# Altium project SymphonyLights_MCU.PrjPcb
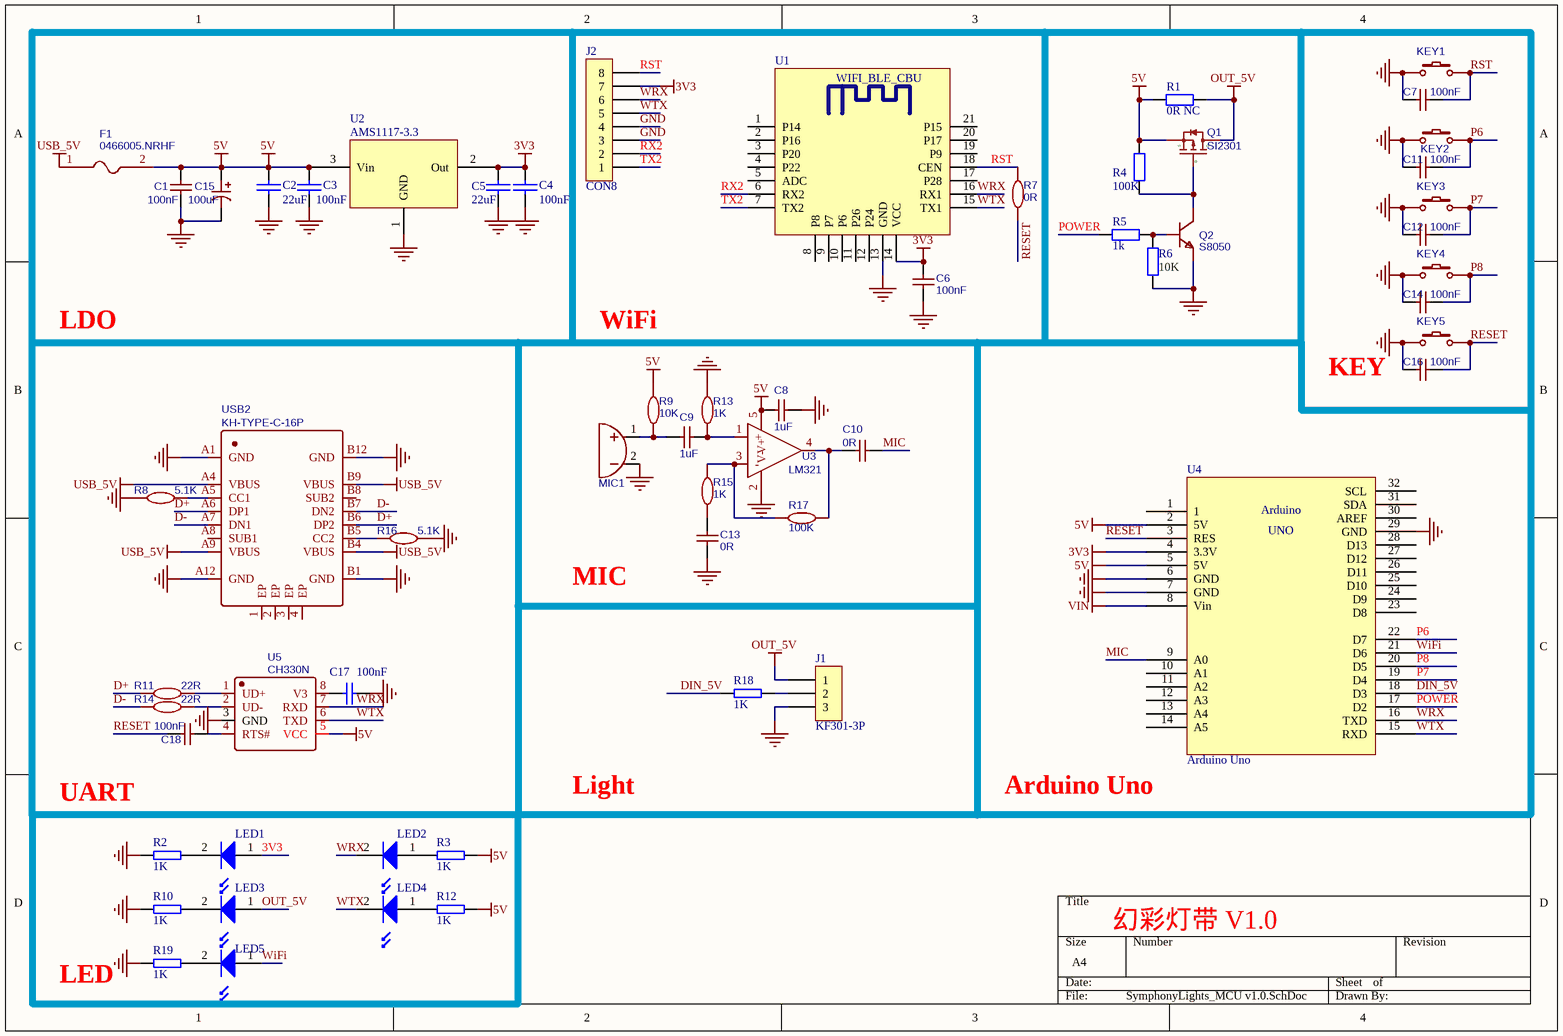
[diagram p0: SymphonyLights_MCU v1.0.SchDoc]
1 sheet, 59 parts. Net scope: global (net labels, ports and power ports of the same name join across sheets).
Board file: SymphonyLights_MCU v1.0.PcbDoc

## Sheet SymphonyLights_MCU v1.0.SchDoc
size A4

### Parts
C1  100nF  [0805C]
C2  22uF  [0805C]
C3  100nF  [0805C]
C4  100nF  [0805C]
C5  22uF  [0805C]
C6  100nF  [0805C]
C7  100nF  [0805C]
C8  1uF  [0805C]
C9  1uF  [0805C]
C10  0R  [0805C]
C11  100nF  [0805C]
C12  100nF  [0805C]
C13  0R  [0805C]
C14  100nF  [0805C]
C15  100uF  [CAP-TH_BD6.3-P2.50-D1.0-FD]
C16  100nF  [0805C]
C17  100nF  [0805C]
C18  100nF  [0805C]
F1  0466005.NRHF  [1206F]
J1  KF301-3P  [SIP3 - 2.54]
J2  CON8  [HDR1X8Z]
KEY1  RESET  [按键]  (value not drawn)
KEY2  场景  [按键]  (value not drawn)
KEY3  音乐  [按键]  (value not drawn)
KEY4  开关  [按键]  (value not drawn)
KEY5  开关  [按键]  (value not drawn)
LED1  LED  [0805LED]  (value not drawn)
LED2  LED  [0805LED]  (value not drawn)
LED3  LED  [0805LED]  (value not drawn)
LED4  LED  [0805LED]  (value not drawn)
LED5  LED  [0805LED]  (value not drawn)
MIC1  GMI6050P-66DB  [MIC-TH_BD6.0-P1.90-D0.4-L-RD]  (value not drawn)
Q1  SI2301  [SOT-23(SOT-23-3)]
Q2  S8050  [SOT-23(SOT-23-3)]
R1  0R NC  [0805R]
R2  1K  [0805R]
R3  1K  [0805R]
R4  100K  [0805R]
R5  1k  [0805R]
R6  10K  [0805R]
R7  0R  [0805R]
R8  5.1K  [0805R]
R9  10K  [0805R]
R10  1K  [0805R]
R11  22R  [0805R]
R12  1K  [0805R]
R13  1K  [0805R]
R14  22R  [0805R]
R15  1K  [0805R]
R16  5.1K  [0805R]
R17  100K  [0805R]
R18  1K  [0805R]
R19  1K  [0805R]
U1  WIFI_BLE_CBU  [WIFI_BLE_CBU]  (value not drawn)
U2  AMS1117-3.3  [SOT-223]
U3  LM321  [SOT-23-5]
U4  Arduino Uno  [Arduino UNO-2]
U5  CH330N  [SOP-8_L4.9-W3.9-P1.27-LS6.0-BL]
USB2  KH-TYPE-C-16P  [USB-C-SMD_KH-TYPE-C-16P]

### Nets
3V3: C4.1 C5.1 C6.2 J2.7 LED1.1 U1.14(VCC) U2.2(Out) U4.4(3.3V)
5V: C1.2 C2.1 C3.1 C8.1 C15.1 F1.2 Q1.2(S) R1.1 R3.1 R4.2 R9.1 R12.1 U2.3(Vin) U3.5(V+) U4.2(5V) U4.5(5V) U5.5(VCC)
GND: C1.1 C2.2 C3.2 C4.2 C5.2 C6.1 C7.1 C8.2 C11.1 C12.1 C13.2 C14.1 C15.2 C16.1 C17.1 J1.3 J2.3 J2.4 KEY1.2 KEY2.1 KEY3.2 KEY4.2 KEY5.2 MIC1.2 Q2.2(E) R2.2 R6.2 R8.1 R10.2 R13.1 R16.1 R19.2 U1.13(GND) U2.1(GND) U3.2(V-) U4.6(GND) U4.7(GND) U4.29(GND) U5.3(GND) USB2.A1(GND) USB2.A12(GND) USB2.B1(GND) USB2.B12(GND)
OUT_5V: J1.1 LED3.1 Q1.3(D) R1.2
USB_5V: F1.1 USB2.A4(VBUS) USB2.A9(VBUS) USB2.B4(VBUS) USB2.B9(VBUS)
VIN: U4.8(Vin)
D+: R11.2 USB2.A6(DP1) USB2.B6(DP2)
D-: R14.2 USB2.A7(DN1) USB2.B7(DN2)
DIN_5V: R18.1 U4.18(D3)
MIC: C10.1 U4.9(A0)
P6: C11.2 KEY2.2 U4.22(D7)
P7: C12.2 KEY3.1 U4.19(D4)
P8: C14.2 KEY4.1 U4.20(D5)
POWER: R5.1 U4.17(D2)
RESET: C16.2 C18.1 KEY5.1 R7.2 U4.3(RES)
RST: C7.2 J2.8 KEY1.1 R7.1 U1.18(CEN)
RX2: J2.2 U1.6(RX2)
TX2: J2.1 U1.7(TX2)
WiFi: LED5.1 U4.21(D6)
WRX: J2.6 LED2.2 U1.16(RX1) U4.16(TXD) U5.7(RXD)
WTX: J2.5 LED4.2 U1.15(TX1) U4.15(RXD) U5.6(TXD)
NetC9_1: C9.1 R13.2 U3.1(+)
NetC9_2: C9.2 MIC1.1 R9.2
NetC10_2: C10.2 R17.2 U3.4
NetC13_1: C13.1 R15.1
NetC17_2: C17.2 U5.8(V3)
NetC18_2: C18.2 U5.4(RTS#)
NetJ1_2: J1.2 R18.2
NetLED1_2: LED1.2 R2.1
NetLED2_1: LED2.1 R3.2
NetLED3_2: LED3.2 R10.1
NetLED4_1: LED4.1 R12.2
NetLED5_2: LED5.2 R19.1
NetQ1_1: Q1.1(G) Q2.3(C) R4.1
NetQ2_1: Q2.1(B) R5.2 R6.1
NetR8_2: R8.2 USB2.A5(CC1)
NetR11_1: R11.1 U5.1(UD+)
NetR14_1: R14.1 U5.2(UD-)
NetR15_2: R15.2 R17.1 U3.3(-)
NetR16_2: R16.2 USB2.B5(CC2)

Not connected (* = marked no-connect by the designer): U1 1(P14) 2(P16) 3(P20) 4(P22) 5(ADC) 8(P8) 9(P7) 10(P6) 11(P26) 12(P24) 17(P28) 19(P9) 20(P17) 21(P15); U4 1 10(A1) 11(A2) 12(A3) 13(A4) 14(A5) 23(D8) 24(D9) 25(D10) 26(D11) 27(D12) 28(D13) 30(AREF) 31(SDA) 32(SCL); USB2 1(EP) 2(EP) 3(EP) 4(EP) A8(SUB1) B8(SUB2)

### Notes on the sheet
- LDO
- WiFi
- KEY
- MIC
- UART
- Light
- (near U4) Arduino Uno
- LED
- 幻彩灯带 V1.0
- (in symbol Arduino Uno) Arduino; UNO

### Library data of the parts
C1 C6-C14 C16 C18 = 100nF: BOM_Manufacturer: FH; BOM_Manufacturer Part: 0805B104K500NT; nameAlias: Capacitance; BOM_Supplier: LCSC; BOM_Supplier Part: C38141; spicePre: C; spiceSymbolName: 0805B104K500NT
C2-C5 = CAP: Capacitor
C15 = 8101LCMAA08E2RR00O: Contributor: LCSC; BOM_Supplier: LCSC; BOM_Supplier Part: C723077; BOM_Manufacturer Part: 8101LCMAA08E2RR00O; JLCPCB Part Class: Extended Part; spicePre: C; spiceSymbolName: 8101LCMAA08E2RR00O
C17 = Cap: 普通电容
F1 = 0466005.NRHF: BOM_Manufacturer: Littelfuse; BOM_Supplier: LCSC; BOM_Manufacturer Part: 0466005.NRHF; BOM_Supplier Part: C57525; spicePre: F; spiceSymbolName: 0466005.NRHF
J1 = CON3: Connector
J2 = CON8: Connector
KEY1-KEY5 = (no symbol name): BOM_Manufacturer Part: K2-1107ST-A4SW-06; Contributor: LCEDA_Lib; BOM_Supplier Part: C118141; BOM_Supplier: LCSC; spicePre: K
MIC1 = GMI6050P-66DB: BOM_Manufacturer: INGHAi; Contributor: LCSC; BOM_Supplier: LCSC; BOM_Supplier Part: C233954; BOM_Manufacturer Part: GMI6050P-66DB; spicePre: M; spiceSymbolName: GMI6050P-66DB
Q1 = SI2301: BOM_Manufacturer: Hottech; Contributor: lengyuefeng; SMT Type: Extend; BOM_Supplier: LCSC; BOM_Manufacturer Part: SI2301; BOM_Supplier Part: C181086; BOM_LCSC Assembly: Yes; spicePre: Q; spiceSymbolName: SI2301
Q2 = S8050: BOM_Manufacturer: CJ; SMT Type: Basic; BOM_Supplier: LCSC; BOM_Manufacturer Part: S8050; image: //image.lceda.cn/szlcsc/C2146.jpg; BOM_Supplier Part: C2146; BOM_LCSC Assembly: Yes; spicePre: Q; spiceSymbolName: S8050
R1 R4-R6 = Res2: Resistor; Published: 8-Jun-2000; LatestRevisionDate: 17-Jul-2002; LatestRevisionNote: Re-released for DXP Platform.; Publisher: Altium Limited
R2 R3 R10 R12 R18 R19 = RES5
R7-R9 R11 R13-R17 = 10K: BOM_Manufacturer: ResistorToday; BOM_Manufacturer Part: AECR0402F10K0K9; nameAlias: Resistance (Ohms); Contributor: LCSC; Package Display: No; BOM_Supplier: LCSC; BOM_Supplier Part: C328298; spicePre: R; spiceSymbolName: AECR0402F10K0K9
U1 = WIFI_BLE_CBU: Module
U2 = GM1117
U3 = LM321: Contributor: KiCAD; license: https://www.gnu.org/licenses/lgpl-2.1.html; spicePre: U; spiceSymbolName: LM321
U5 = CH330N: BOM_Manufacturer: WCH; BOM_Supplier: LCSC; BOM_Manufacturer Part: CH330N; BOM_Supplier Part: C108996; spicePre: U; spiceSymbolName: CH330N
USB2 = KH-TYPE-C-16P: BOM_Manufacturer: Shenzhen Kinghelm Elec; Contributor: LCSC; BOM_Supplier: LCSC; BOM_Supplier Part: C709357; BOM_Manufacturer Part: KH-TYPE-C-16P; BOM_JLCPCB Part Class: Extended Part; spicePre: U; spiceSymbolName: KH-TYPE-C-16P
LED1-LED5 = LED: Published: *; LatestRevisionDate: *; LatestRevisionNote: *; DatasheetDocument: *; PackageDocument: *; PackageReference: *; Publisher: *; ComponentLink1Description: *; ComponentLink1URL: *; Code_JEDEC: *